# Altium schematic sheet microSDHC_SDIO.SchDoc
size A4
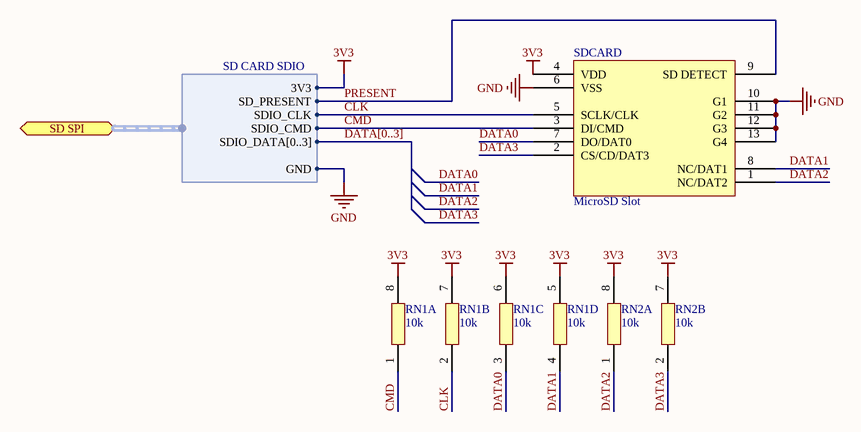
[diagram p0: microSDHC_SDIO.SchDoc]

## Parts
RN1  10k  [1206 Resistor Network]  (parts A,B,C,D of 4)
RN2  10k  [1206 Resistor Network]  (parts A,B of 4)
SDCARD  MicroSD Slot  [MICROSD Slot]

## Ports
SD SPI (harness SD CARD SDIO)

## Harnesses
SD CARD SDIO: SD_PRESENT, GND, 3V3, SDIO_CLK, SDIO_DATA[0..3], SDIO_CMD

## Nets
3V3: RN1.5 RN1.6 RN1.7 RN1.8 RN2.7 RN2.8 SDCARD.4(VDD) ; port SD SPI.3V3
GND: SDCARD.6(VSS) SDCARD.10(G1) SDCARD.11(G2) SDCARD.12(G3) SDCARD.13(G4) ; port SD SPI.GND
CLK: RN1.2 SDCARD.5(SCLK/CLK) ; port SD SPI.SDIO_CLK
CMD: RN1.1 SDCARD.3(DI/CMD) ; port SD SPI.SDIO_CMD
DATA0: RN1.3 SDCARD.7(DO/DAT0)
DATA1: RN1.4 SDCARD.8(NC/DAT1)
DATA2: RN2.1 SDCARD.1(NC/DAT2)
DATA3: RN2.2 SDCARD.2(CS/CD/DAT3)
PRESENT: SDCARD.9(SD_DETECT) ; port SD SPI.SD_PRESENT

## Buses and harness runs
bus DATA[0..3]

## Library data of the parts
RN1 RN2 = 1206 Resistor Network: Value: 1k